# Altium project Placa potência rev. C.PrjPcb
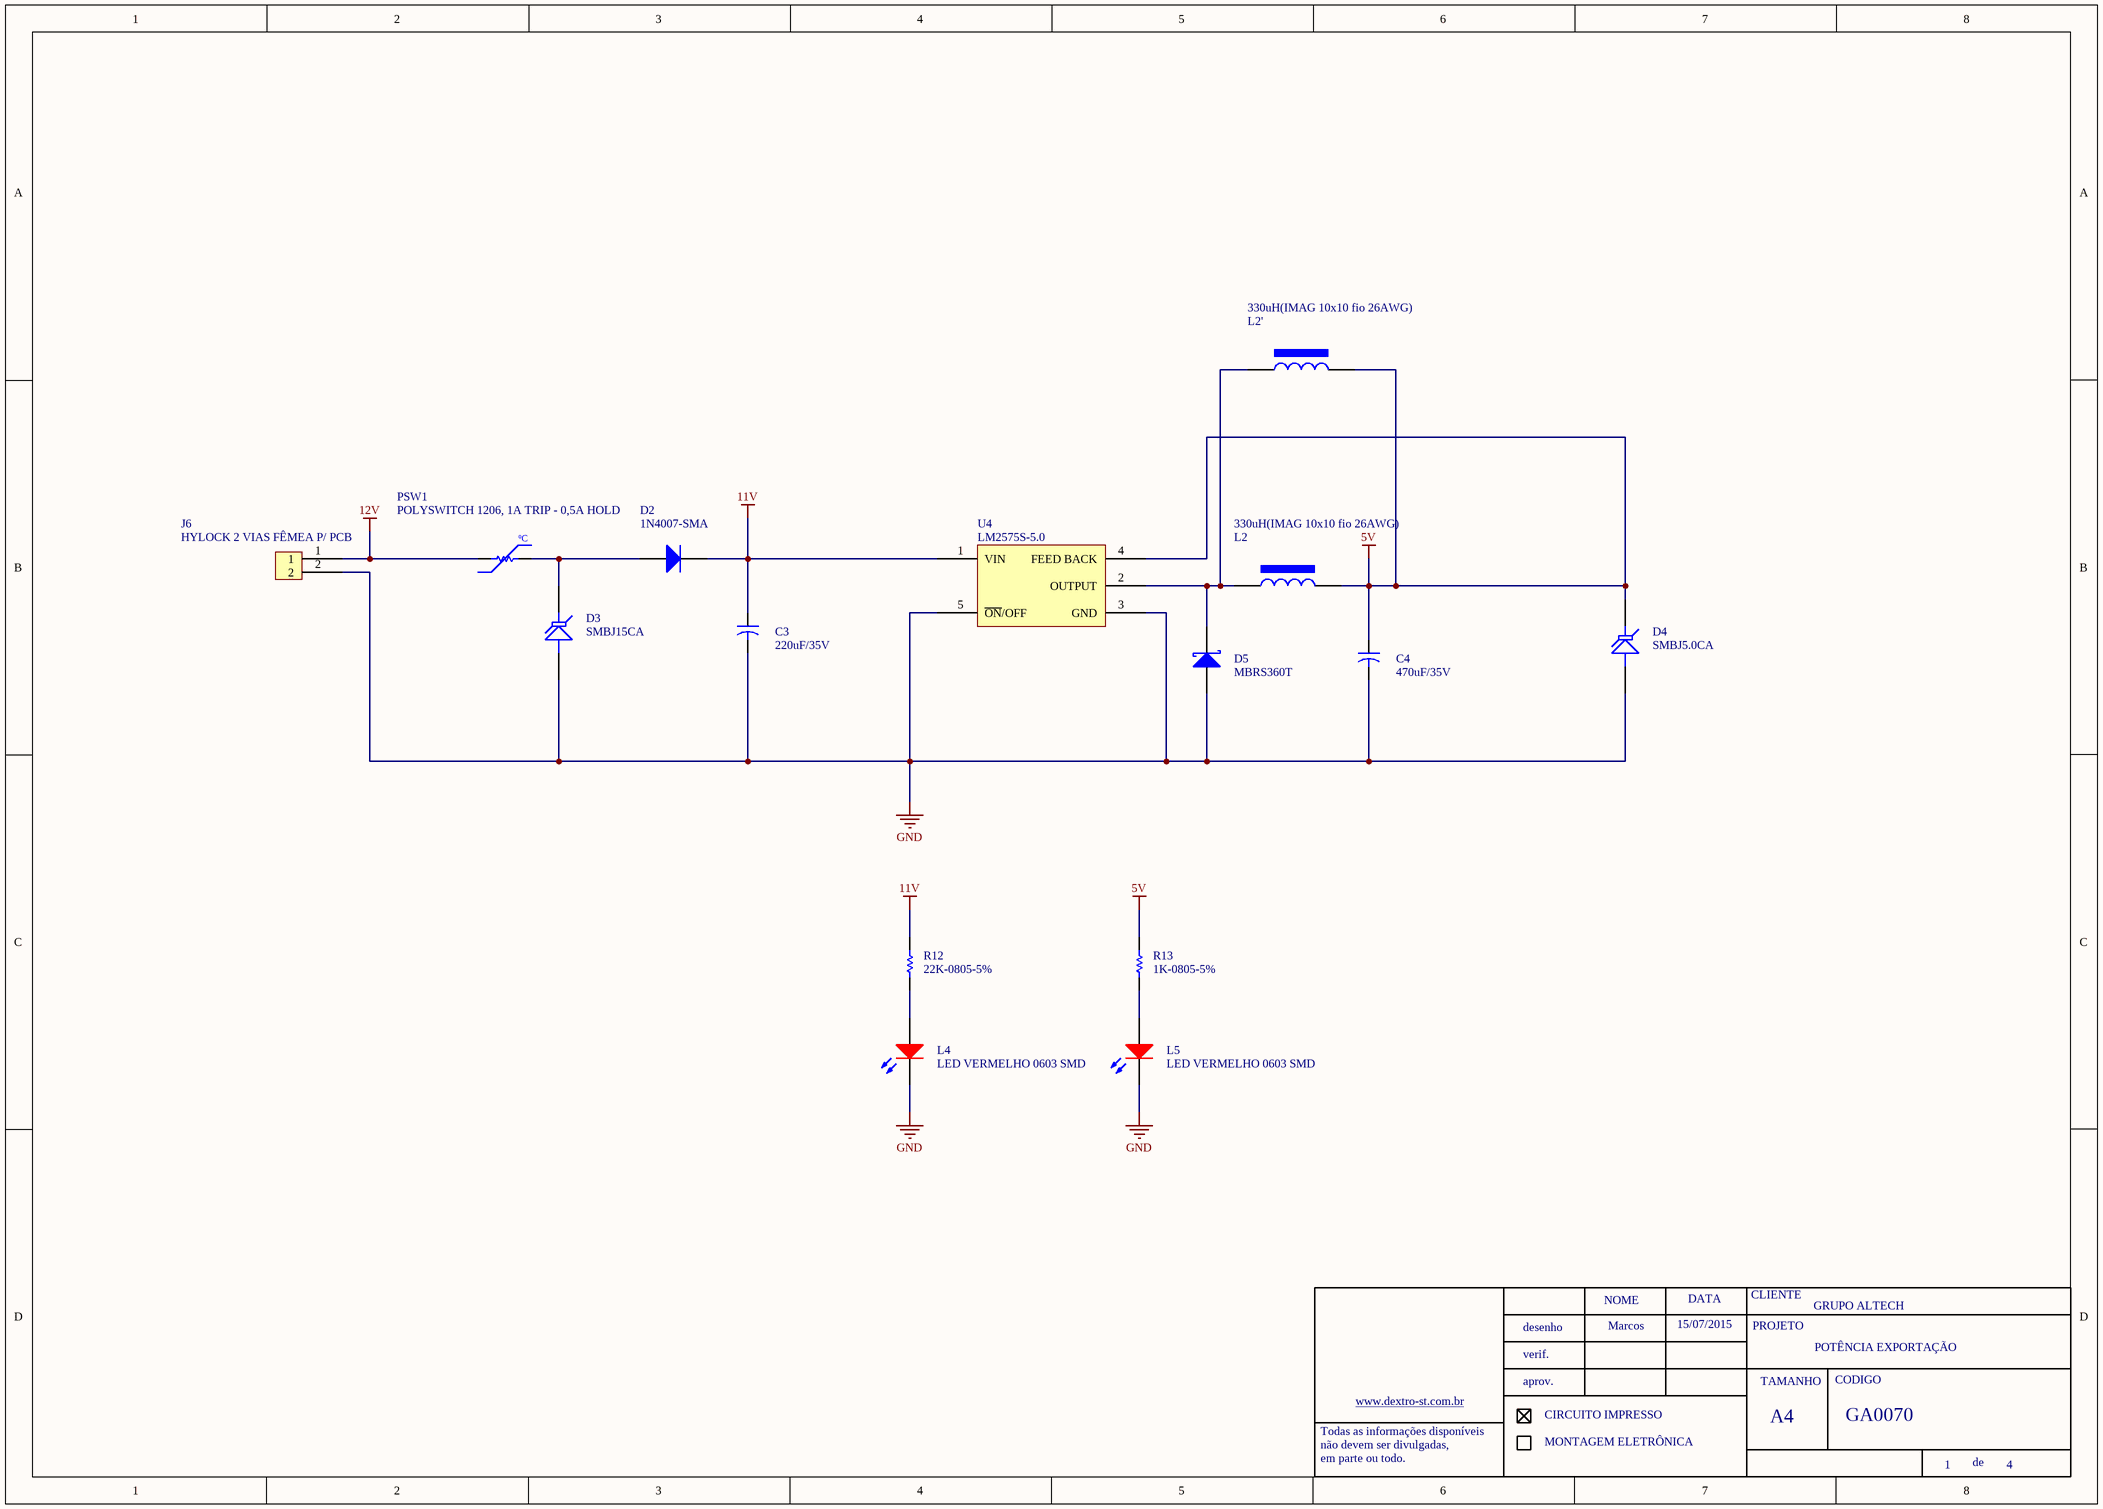
[diagram p0: Regulador.SchDoc]
5 sheets, 80 parts. Net scope: global (net labels, ports and power ports of the same name join across sheets).
Board file: PlacaPotenciaMPG2.PcbDoc
Sheets:
  Regulador.SchDoc
  Sincronismo.SchDoc
  Conectores.SchDoc
  Potencia.SchDoc
  ControleSSR.SchDoc

## Sheet Regulador.SchDoc: GRUPO ALTECH
size A3; DocumentNumber: GA0070; SheetNumber: 1; SheetTotal: 4

### Parts
C3  220uF/35V  [CAP POL 8x12mm]
C4  470uF/35V  [CAP POL 8x12mm]
D2  1N4007-SMA  [DO-214AA]
D3  SMBJ15CA  [DO-214AA]
D4  SMBJ5.0CA  [DO-214AA]
D5  MBRS360T  [DO-214AA]
J6  HYLOCK 2 VIAS FÊMEA P/ PCB  [CONECTOR HYLOCK 2 VIAS]
L2  330uH(IMAG 10x10 fio 26AWG)  [INDUTOR 47mH]
L2'  330uH(IMAG 10x10 fio 26AWG)  [INDUTOR LOCO]
L4  LED VERMELHO 0603 SMD  [LED 1206]
L5  LED VERMELHO 0603 SMD  [LED 1206]
PSW1  POLYSWITCH 1206, 1A TRIP - 0,5A HOLD  [1206-REVISADO ONDA]
R12  22K-0805-5%  [0805-REVISADO ONDA]
R13  1K-0805-5%  [0805-REVISADO ONDA]
U4  LM2575S-5.0  [TO-263-5]

### Nets
5V: C4.1 D4.2(K) L2.1 L2'.1 R13.2 U4.4(FEED_BACK)
11V: C3.1 D2.2(K) R12.2 U4.1(VIN)
12V: J6.1 PSW1.1
GND: C3.2 C4.2 D3.1(A) D4.1(A) D5.1(A) J6.2 L4.2(K) L5.2(K) U4.3(GND) U4.5(~{ON}/OFF)
NetD2_1: D2.1(A) D3.2(K) PSW1.2
NetD5_2: D5.2(K) L2.2 L2'.2 U4.2(OUTPUT)
NetL4_1: L4.1(A) R12.1
NetL5_1: L5.1(A) R13.1

### Notes on the sheet
- Marcos
- 15/07/2015
- POTÊNCIA EXPORTAÇÃO
- NOME
- DATA
- CLIENTE
- PROJETO
- desenho
- verif.
- aprov.
- TAMANHO
- CODIGO
- Todas as informações disponíveis
- não devem ser divulgadas,
- em parte ou todo.
- www.dextro-st.com.br
- CIRCUITO IMPRESSO
- MONTAGEM ELETRÔNICA
- A4
- de
- (in symbol POLYSWITCH 200mA) ºC

### Library data of the parts
C3 = 2200uF/50V: ERP: 105.01.008
C4 = 470uF/50V: ERP: 105.01.005
D2 = 1N4007: ERP: 120.18.001
D3 = SMBJ30.0A: ERP: 128.02.003
D4 = SMBJ5.0A: ERP: 128.02.002
D5 = 1N5819-SOD80: ERP: 121.18.003
J6 = PCMC2-2
L2 L2' = indutor 1mH CNF15: 1mH-CNF15-26 AWG; ERP: 211.00.012
PSW1 = POLYSWITCH 200mA: NANOSMDC020F-2; ERP: 128.12.002
R13 = 22K-0805-5%: ERP: 102.11.058
U4 = LM2596S-ADJ
L4 L5 = LED VERMELHO 0603 SMD: ERP: 124.02.010
R12 = 22K-0805-5%: ERP: 102.11.058

## Sheet Sincronismo.SchDoc: GRUPO ALTECH
size A3; DocumentNumber: GA0070; SheetNumber: 2; SheetTotal: 4; PageSetup: Record=PageOptions|CenterHorizontal=True|CenterVertical=True|PrintScale=0.71|XCorrection=1.00|YCorrection=1.00|PrintKind=0|BorderSize=5000000|LeftOffset=0|BottomOffset=0|Orientation=2|PaperLength=1000|PaperWidth=1000|Scale=100|PaperSource=7|PrintQuality=-3|MediaType=1|DitherType=10|PrintScaleMode=1|PaperKind=A4|PaperIndex=9
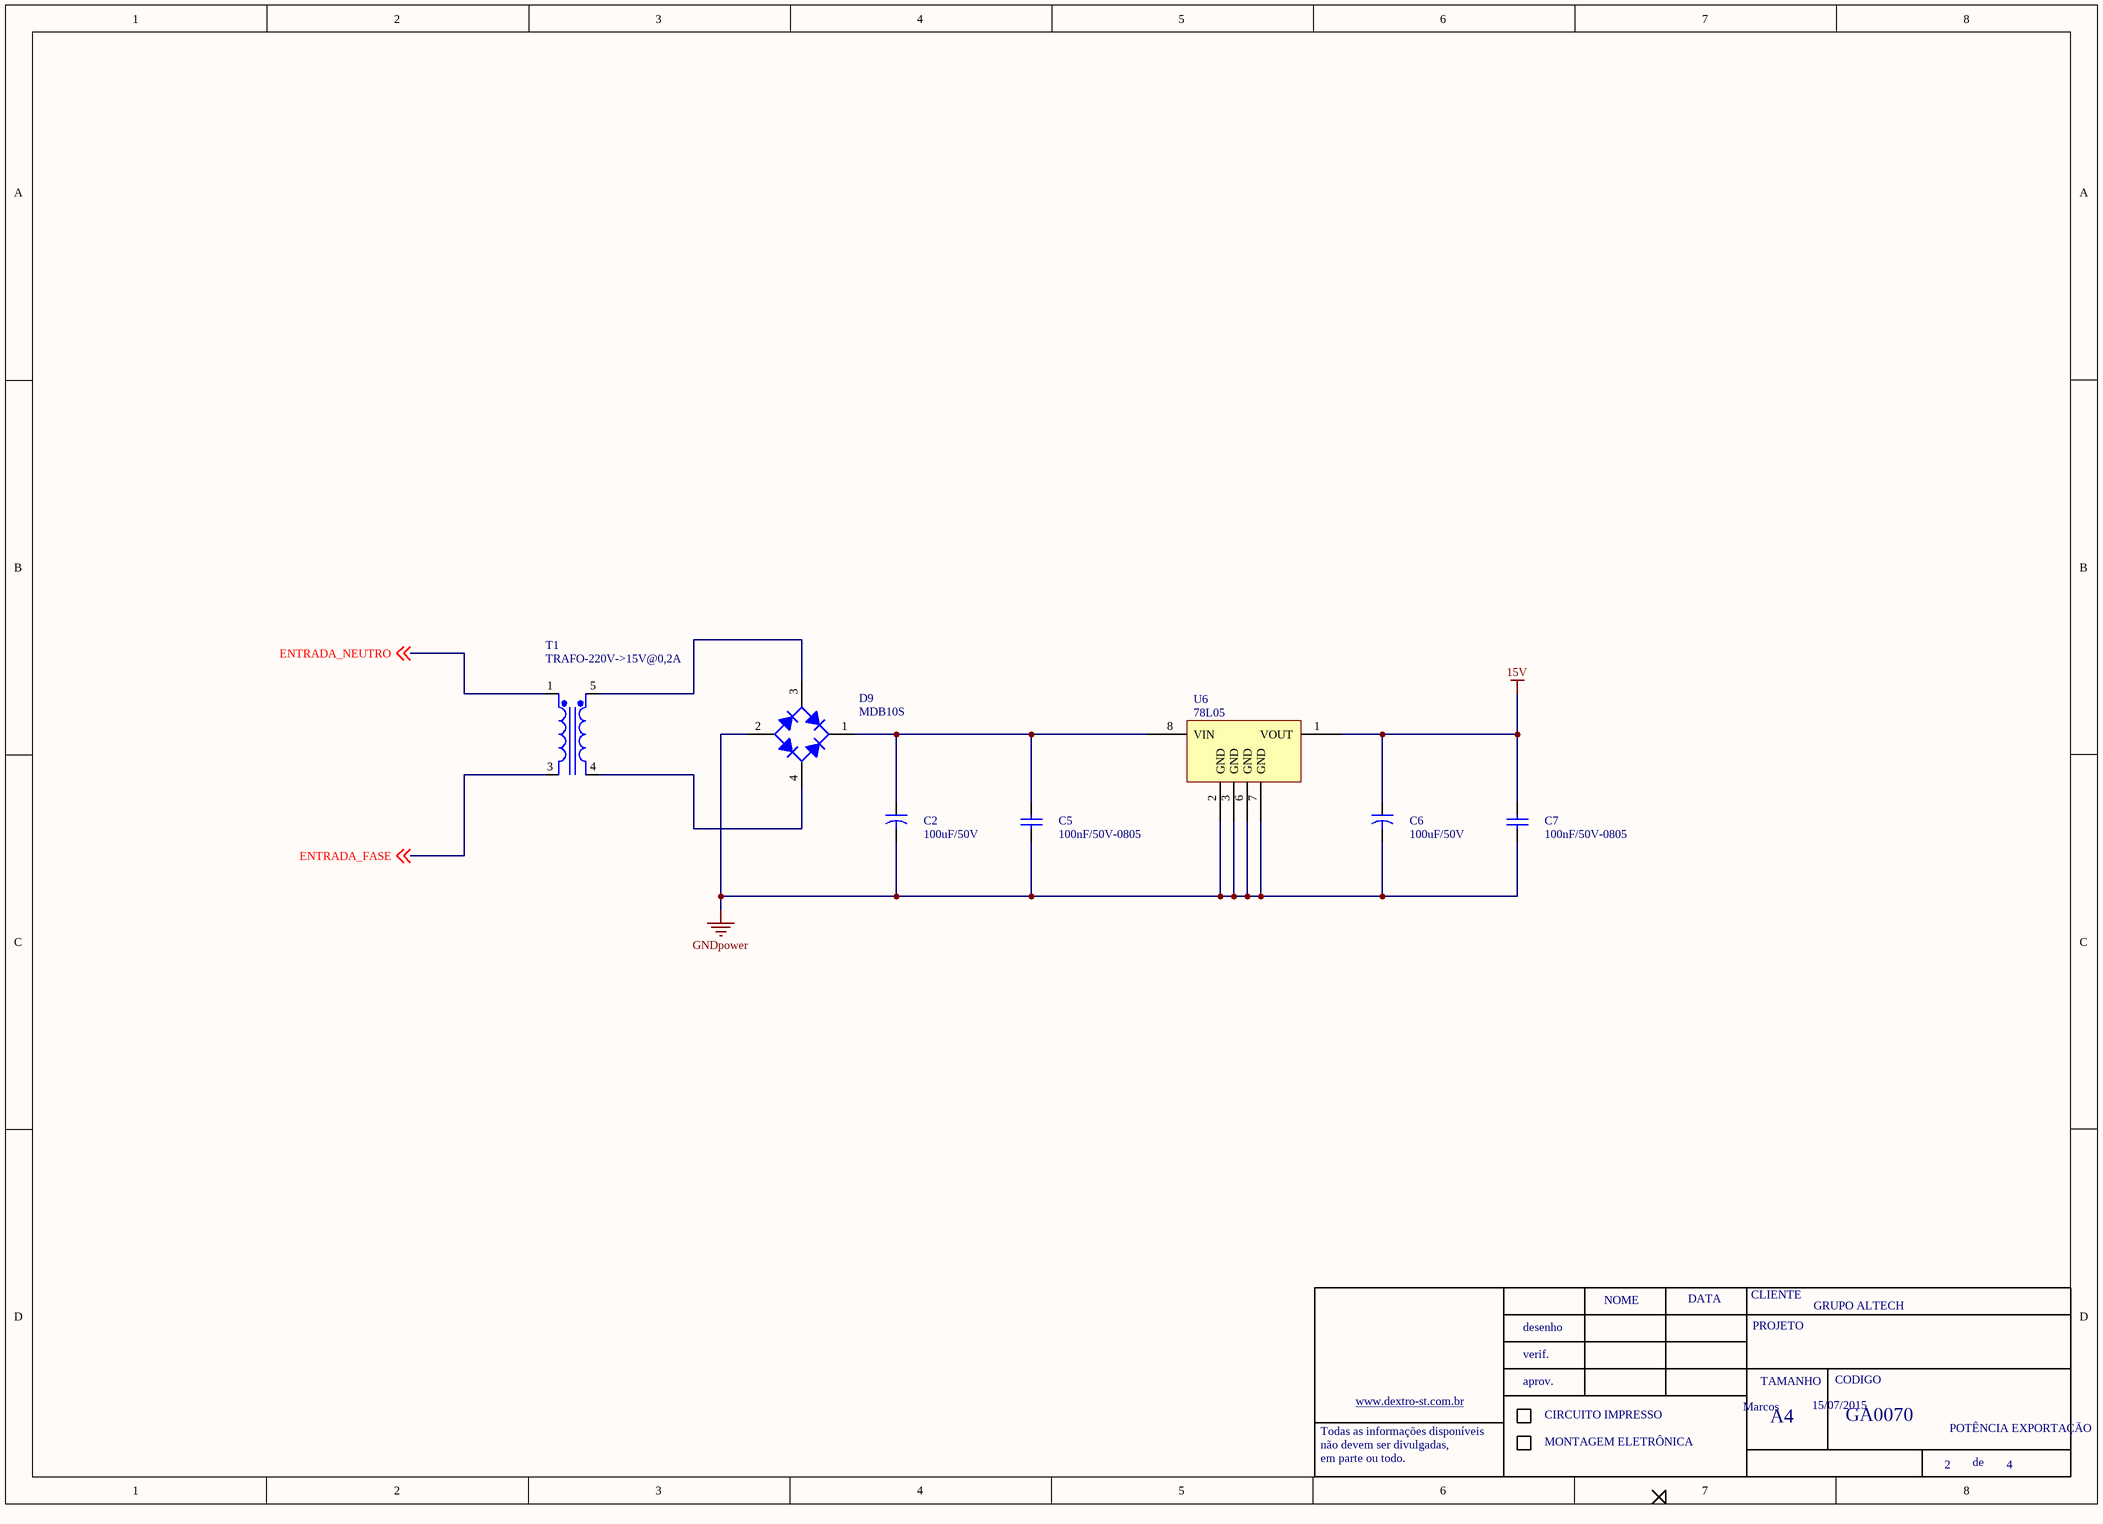
[diagram p1: Sincronismo.SchDoc]

### Parts
C2  100uF/50V  [CAP POL 8x12mm]
C5  100nF/50V-0805  [0805-REVISADO ONDA]
C6  100uF/50V  [CAP POL 8x12mm]
C7  100nF/50V-0805  [0805-REVISADO ONDA]
D9  MDB10S  [MICRO DIP MDB10S]
T1  TRAFO-220V->15V@0,2A
U6  78L05  [SOIC-08]

### Nets
15V: C6.1 C7.2 U6.1(VOUT)
GNDpower: C2.2 C5.1 C6.2 C7.1 D9.2(A) U6.2(GND) U6.3(GND) U6.6(GND) U6.7(GND)
ENTRADA_FASE: T1.3 ; off-sheet ENTRADA_FASE
ENTRADA_NEUTRO: T1.1 ; off-sheet ENTRADA_NEUTRO
NetC2_1: C2.1 C5.2 D9.1(K) U6.8(VIN)
NetD9_3: D9.3(C) T1.5
NetD9_4: D9.4(C) T1.4

### Notes on the sheet
- Marcos
- 15/07/2015
- POTÊNCIA EXPORTAÇÃO
- NOME
- DATA
- CLIENTE
- PROJETO
- desenho
- verif.
- aprov.
- TAMANHO
- CODIGO
- Todas as informações disponíveis
- não devem ser divulgadas,
- em parte ou todo.
- www.dextro-st.com.br
- CIRCUITO IMPRESSO
- MONTAGEM ELETRÔNICA
- A4
- de

### Library data of the parts
C5 C7 = 100nF/50-0805-NPO: ERP: 104.11.005
T1 = TRAFO CORRENTE: TRAFO CORRENTE 1A-5V; ERP: 210.00.006
U6 = 78L05-SOIC
C2 C6 = 100uF/50V: ERP: 105.01.003

## Sheet Conectores.SchDoc: GRUPO ALTECH
size A3; DocumentNumber: GA0070; SheetNumber: 3; SheetTotal: 4
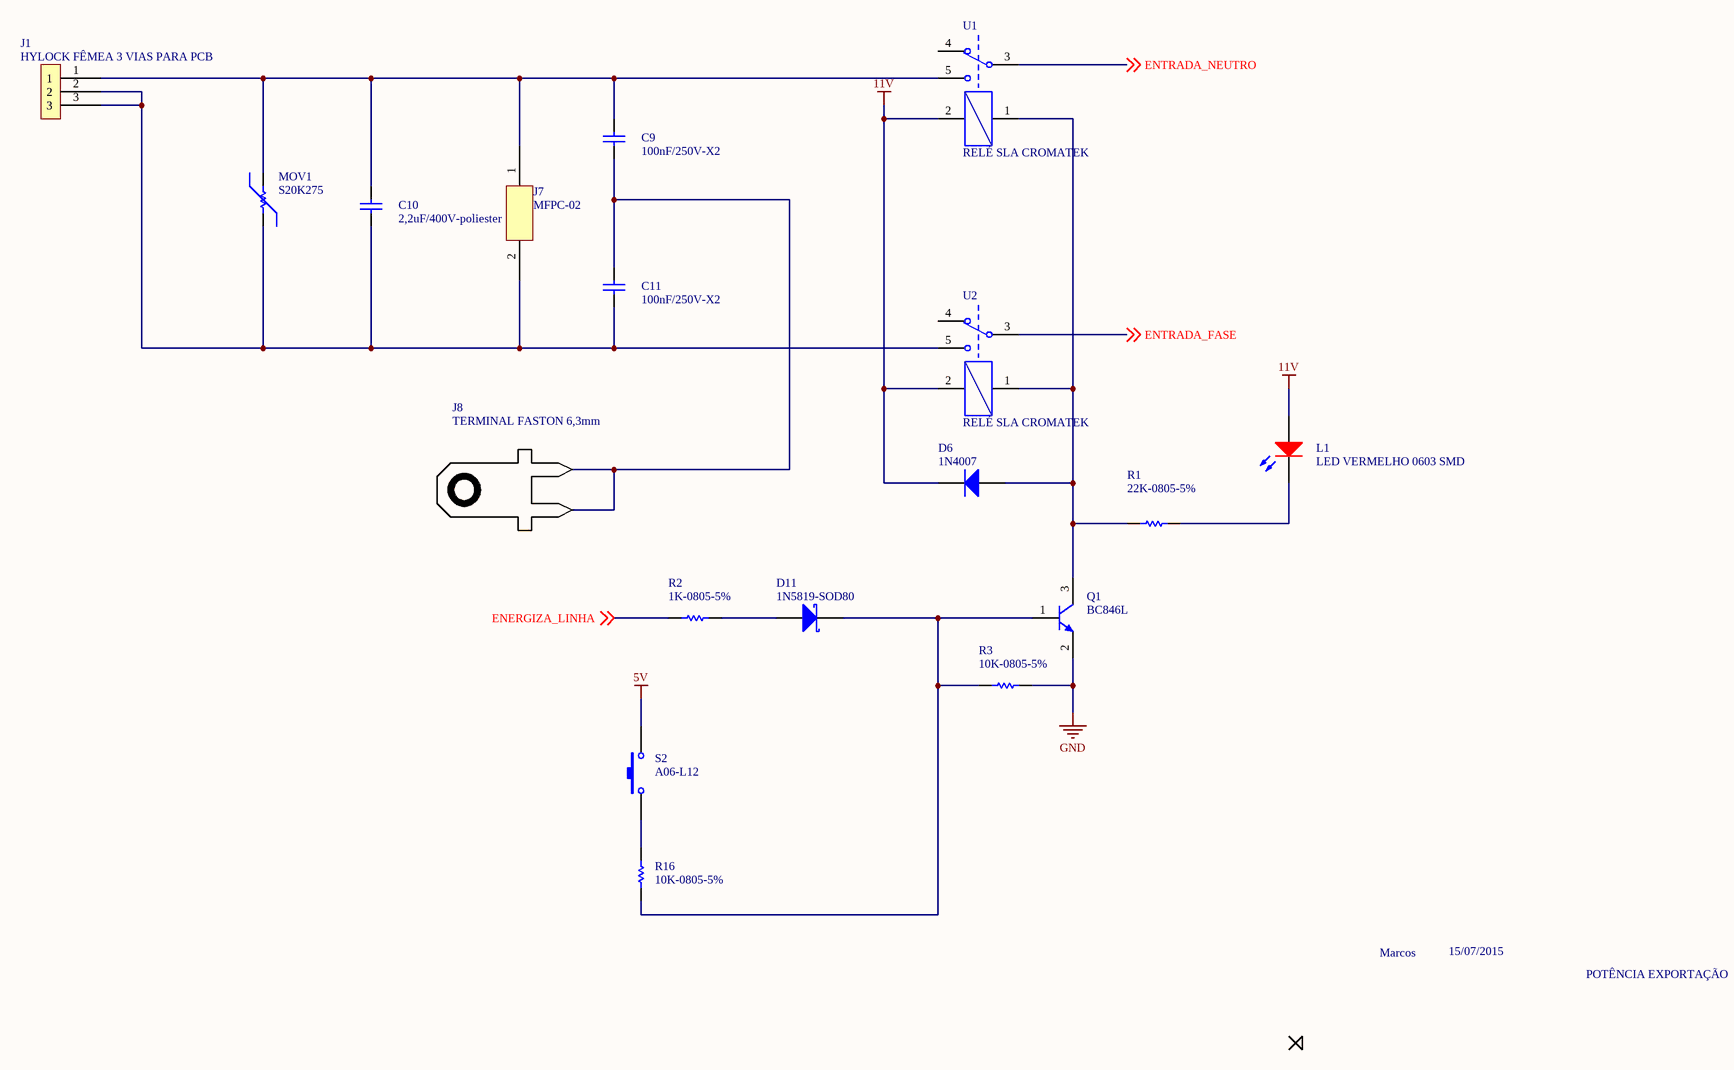
[diagram p2: Conectores.SchDoc]

### Parts
C9  100nF/250V-X2  [CAP-250V-PS]
C10  2,2uF/400V-poliester  [CAPACITOR H4]
C11  100nF/250V-X2  [CAP-250V-PS]
D6  1N4007  [SMA DIODES]
D11  1N5819-SOD80  [MINIMLEF/SOD80 - REVISADO ONDA]
J1  HYLOCK FÊMEA 3 VIAS PARA PCB  [CONECTOR HYLOCK 3 VIAS]
J7  MFPC-02  [MFPC-02]
J8  TERMINAL FASTON 6,3mm  [TERMINAL FASTON]
L1  LED VERMELHO 0603 SMD  [LED 1206]
MOV1  S20K275  [VARISTOR 20mm]
Q1  BC846L  [SOT23 - REVISADO ONDA]
R1  22K-0805-5%  [0805-REVISADO ONDA]
R2  1K-0805-5%  [0805-REVISADO ONDA]
R3  10K-0805-5%  [0805-REVISADO ONDA]
R16  10K-0805-5%  [0805-REVISADO ONDA]
S2  A06-L12  [CHAVE_A06]
U1  RELÉ SLA CROMATEK  [RELE SLA CROMATEK]
U2  RELÉ SLA CROMATEK  [RELE SLA CROMATEK]

### Nets
5V: S2.2
11V: D6.2(K) L1.1(A) U1.2(A2) U2.2(A2)
GND: Q1.2(E) R3.2
ENERGIZA_LINHA: R2.1 ; off-sheet ENERGIZA_LINHA
ENTRADA_FASE: U2.3 ; off-sheet ENTRADA_FASE
ENTRADA_NEUTRO: U1.3 ; off-sheet ENTRADA_NEUTRO
NetC9_1: C9.1 C11.2 J8.1 J8.2
NetC9_2: C9.2 C10.2 J1.1 J7.1 MOV1.2 U1.5
NetC10_1: C10.1 C11.1 J1.2 J1.3 J7.2 MOV1.1 U2.5
NetD6_1: D6.1(A) Q1.3(C) R1.1 U1.1(A1) U2.1(A1)
NetD11_1: D11.1(A) R2.2
NetD11_2: D11.2(K) Q1.1(B) R3.1 R16.1
NetL1_2: L1.2(K) R1.2
NetR16_2: R16.2 S2.1

Not connected (* = marked no-connect by the designer): U1 4; U2 4

### Notes on the sheet
- Marcos
- 15/07/2015
- POTÊNCIA EXPORTAÇÃO
- NOME
- DATA
- CLIENTE
- PROJETO
- desenho
- verif.
- aprov.
- TAMANHO
- CODIGO
- Todas as informações disponíveis
- não devem ser divulgadas,
- em parte ou todo.
- www.dextro-st.com.br
- CIRCUITO IMPRESSO
- MONTAGEM ELETRÔNICA
- A4
- de

### Library data of the parts
C9-C11 = 100nF/50-0805-NPO: 100nF/50V-0805; ERP: 104.11.005
J1 = PCMC2-3
J7 = MFPL-02
Q1 = BC846: ERP: 106.22.001
R2 = 10K-0805-5%: ERP: 102.11.054
R16 = 1K-0805-5%: ERP: 102.11.042
D6 = 1N4007: ERP: 120.18.001
D11 = 1N5819-SOD80: ERP: 121.18.003
J8 = TERMINAL FASTON 6,3mm: ERP: 431.00.010
L1 = LED VERMELHO 0603 SMD: ERP: 124.02.010
R1 = 22K-0805-5%: ERP: 102.11.058
R3 = 10K-0805-5%: ERP: 102.11.054
S2 = A06-L12: ERP: 136.00.001

## Sheet Potencia.SchDoc: GRUPO ALTECH
size A3; DocumentNumber: GA0070; SheetNumber: 4; SheetTotal: 4
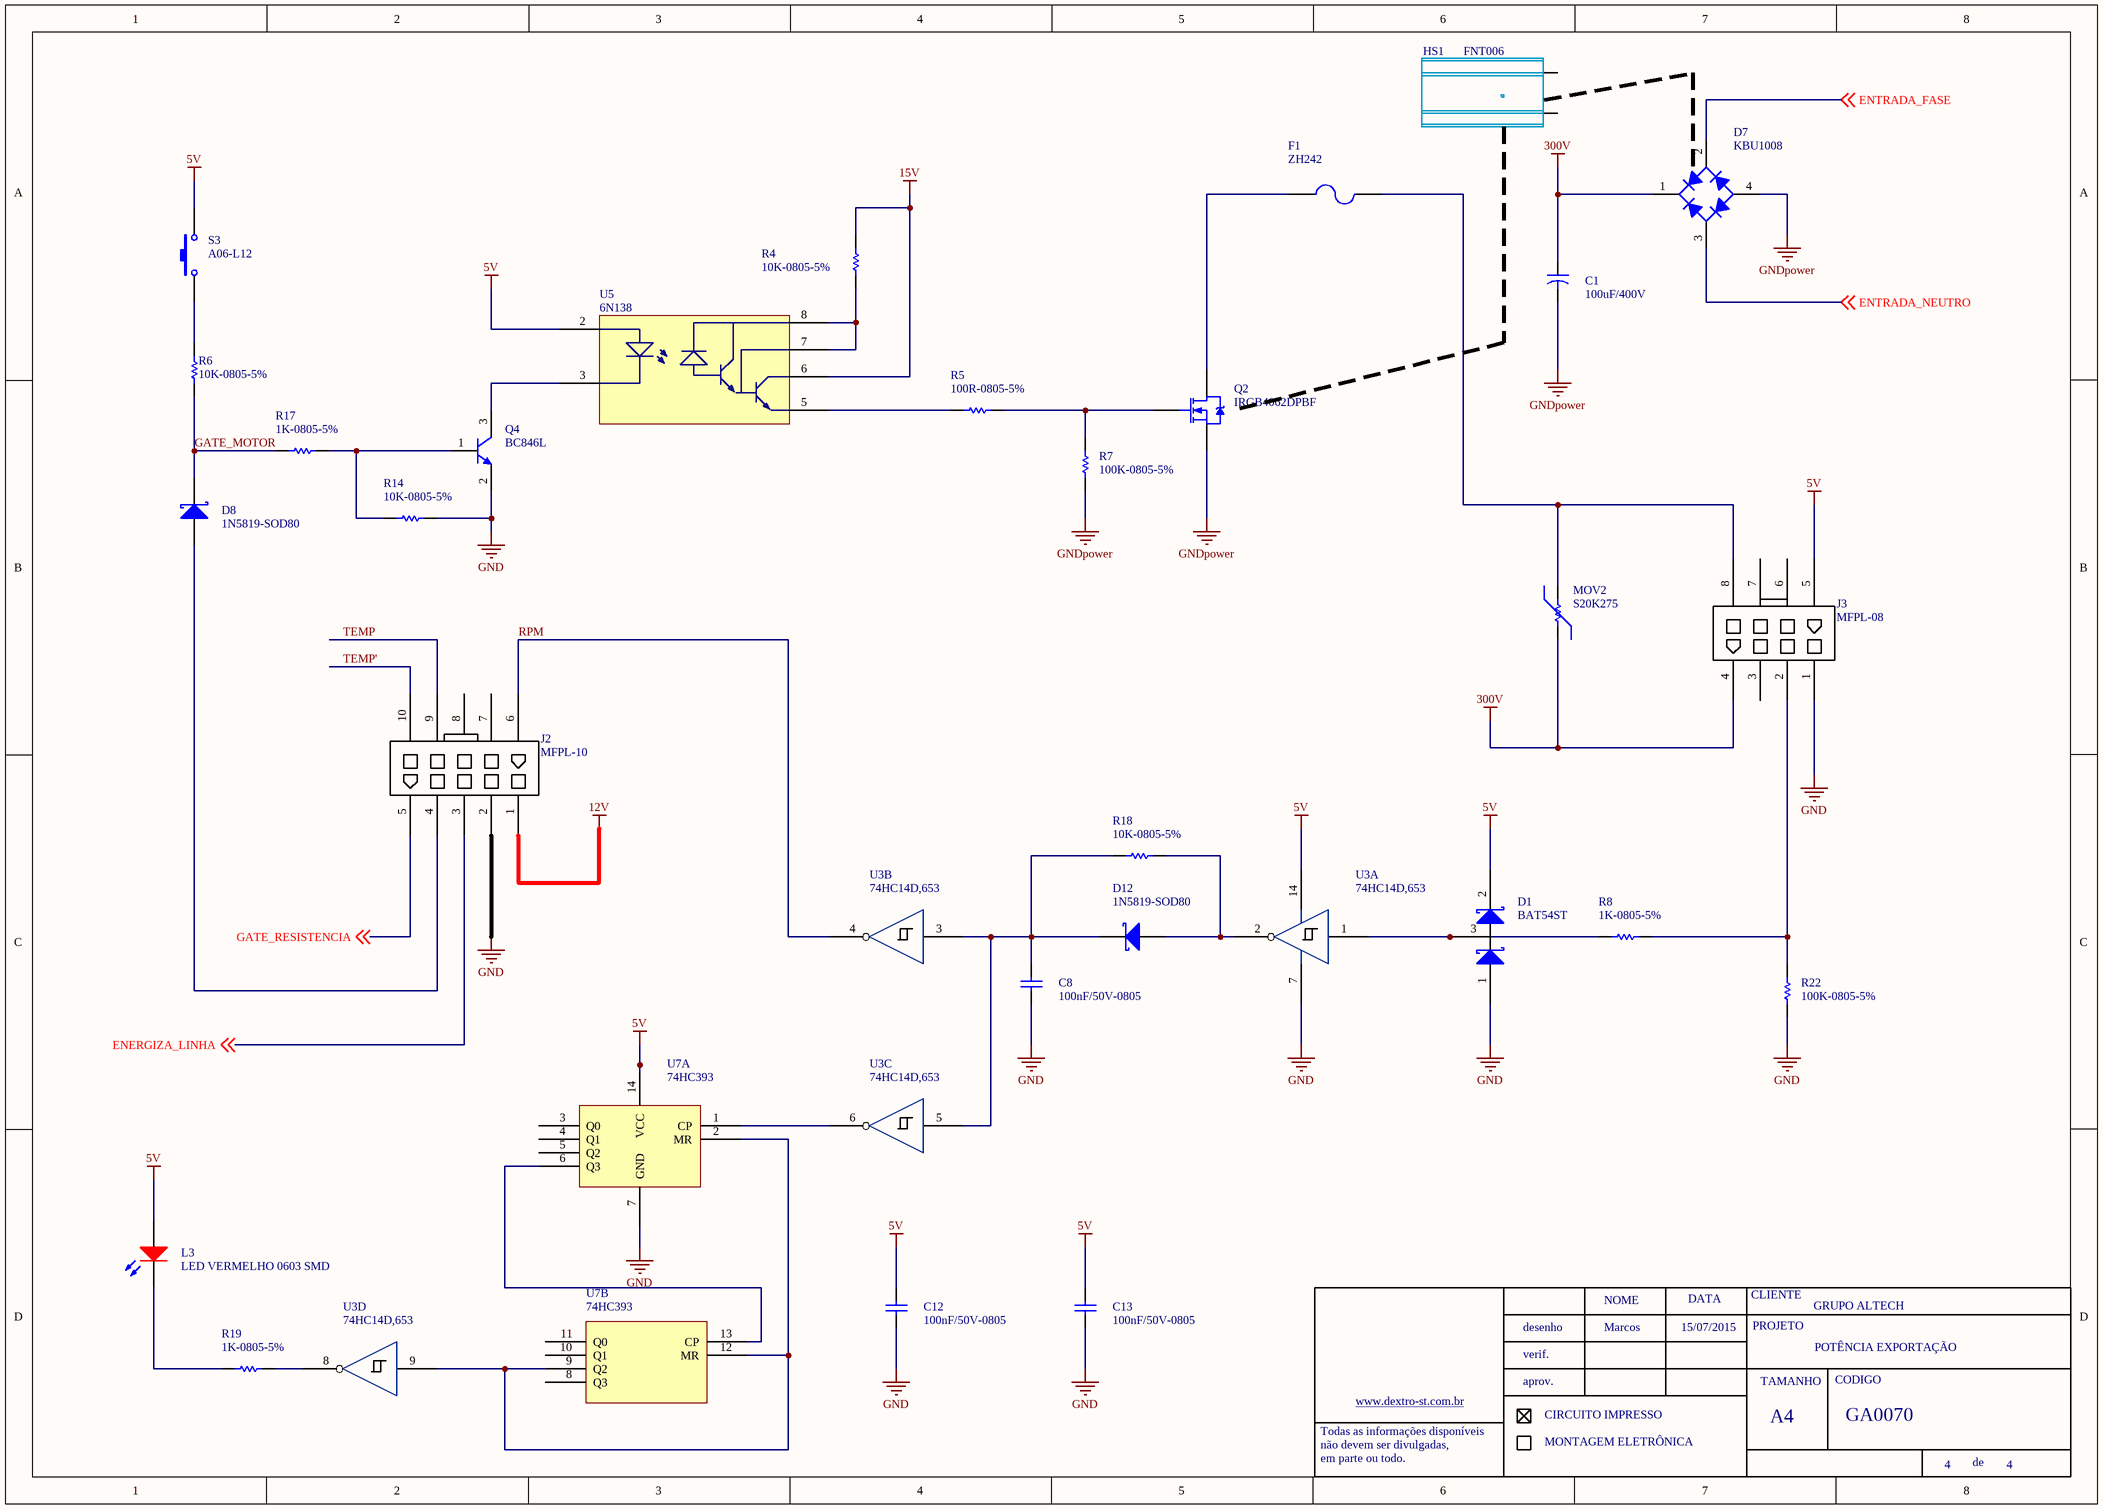
[diagram p3: Potencia.SchDoc]

### Parts
C1  100uF/400V  [CAP 470UF/400V HITANO]
C8  100nF/50V-0805  [0805-REVISADO ONDA]
C12  100nF/50V-0805  [0805-REVISADO ONDA]
C13  100nF/50V-0805  [0805-REVISADO ONDA]
D1  BAT54ST  [SOT23 - REVISADO ONDA]
D7  KBU1008  [KBU-810]
D8  1N5819-SOD80  [MINIMLEF/SOD80 - REVISADO ONDA]
D12  1N5819-SOD80  [MINIMLEF/SOD80 - REVISADO ONDA]
F1  ZH242  [ZH242_REVISADO]
HS1  FNT006  [dissipador grande]
J2  MFPL-10  [MFPC-10]
J3  MFPL-08  [MFPC-08]
L3  LED VERMELHO 0603 SMD  [LED 1206]
MOV2  S20K275  [VARISTOR 20mm]
Q2  IRGB4062DPBF  [TO220-3 EM PÉ]
Q4  BC846L  [SOT23 - REVISADO ONDA]
R4  10K-0805-5%  [0805-REVISADO ONDA]
R5  100R-0805-5%  [0805-REVISADO ONDA]
R6  10K-0805-5%  [0805-REVISADO ONDA]
R7  100K-0805-5%  [0805-REVISADO ONDA]
R8  1K-0805-5%  [0805-REVISADO ONDA]
R14  10K-0805-5%  [0805-REVISADO ONDA]
R17  1K-0805-5%  [0805-REVISADO ONDA]
R18  10K-0805-5%  [0805-REVISADO ONDA]
R19  1K-0805-5%  [0805-REVISADO ONDA]
R22  100K-0805-5%  [0805-REVISADO ONDA]
S3  A06-L12  [CHAVE_A06]
U3  74HC14D,653  [SOIC 14 PINOS]  (parts A,B,C,D of 6)
U5  6N138  [DIP-8]
U7  74HC393  [SOIC 14 PINOS]  (parts A,B of 2)

### Nets
5V: C12.2 C13.2 D1.2 J3.5 L3.1(A) S3.2 U3.14(VCC) U5.2(A) U7.14(VCC)
12V: J2.1
15V: R4.2 U5.6
300V: C1.1 D7.1(K) J3.4 MOV2.2
GND: C8.1 C12.1 C13.1 D1.1 J2.2 J3.1 Q4.2(E) R14.2 R22.1 U3.7(GND) U7.7(GND)
GNDpower: C1.2 D7.4(A) Q2.3(S) R7.1
ENERGIZA_LINHA: J2.3 ; off-sheet ENERGIZA_LINHA
ENTRADA_FASE: D7.2(C) ; off-sheet ENTRADA_FASE
ENTRADA_NEUTRO: D7.3(C) ; off-sheet ENTRADA_NEUTRO
GATE_MOTOR: D8.2(K) R6.2 R17.1
GATE_RESISTENCIA: J2.5 ; off-sheet GATE_RESISTENCIA
RPM: J2.6 U3.4
TEMP: J2.9
TEMP': J2.10
NetC8_2: C8.2 D12.2(K) R18.1 U3.3 U3.5
NetD1_3: D1.3 R8.1 U3.1
NetD8_1: D8.1(A) J2.4
NetD12_1: D12.1(A) R18.2 U3.2
NetF1_1: F1.1 J3.8 MOV2.1
NetF1_2: F1.2 Q2.2(D)
NetJ3_2: J3.2 R8.2 R22.2
NetL3_2: L3.2(K) R19.2
NetQ2_1: Q2.1(G) R5.2 R7.2
NetQ4_1: Q4.1(B) R14.1 R17.2
NetQ4_3: Q4.3(C) U5.3(K)
NetR4_1: R4.1 U5.7 U5.8
NetR5_1: R5.1 U5.5(GND)
NetR6_1: R6.1 S3.1
NetR19_1: R19.1 U3.8
NetU3_6: U3.6 U7.1(CP)
NetU3_9: U3.9 U7.2(MR) U7.9(Q2) U7.12(MR)
NetU7_6: U7.6(Q3) U7.13(CP)

Not connected (* = marked no-connect by the designer): HS1 0 1; J2 7 8; J3 3 6 7; U7 3(Q0) 4(Q1) 5(Q2) 8(Q3) 10(Q1) 11(Q0)

### Notes on the sheet
- Marcos
- 15/07/2015
- POTÊNCIA EXPORTAÇÃO
- NOME
- DATA
- CLIENTE
- PROJETO
- desenho
- verif.
- aprov.
- TAMANHO
- CODIGO
- Todas as informações disponíveis
- não devem ser divulgadas,
- em parte ou todo.
- www.dextro-st.com.br
- CIRCUITO IMPRESSO
- MONTAGEM ELETRÔNICA
- A4
- de

### Library data of the parts
C1 = 100uF/50V: ERP: 105.01.003
C8 C12 C13 = 100nF/50-0805-NPO: ERP: 104.11.005
D7 = KBU 1008: ERP: 170.01.001
F1 = PORTA FUSÍVEL TIPO BERÇO: ERP: 426.00.002
HS1 = DISSIPADOR 40mm PÉ
Q2 = IRF740: ERP: 107.01.021
Q4 = BC846: ERP: 106.22.001
R4 = 100R-0805-5%: ERP: 102.11.031
R17 = 10K-0805-5%: ERP: 102.11.054
U3 = 74HC14D
U5 = 6N138: ERP: FALTA CADASTRAR
D8 D12 = 1N5819-SOD80: ERP: 121.18.003
L3 = LED VERMELHO 0603 SMD: ERP: 124.02.010
R5 = 100R-0805-5%: ERP: 102.11.031
R6 R14 R18 = 10K-0805-5%: ERP: 102.11.054
R7 R22 = 100K-0805-5%: ERP: 102.11.066
R8 R19 = 1K-0805-5%: ERP: 102.11.042
S3 = A06-L12: ERP: 136.00.001

## Sheet ControleSSR.SchDoc
size A3
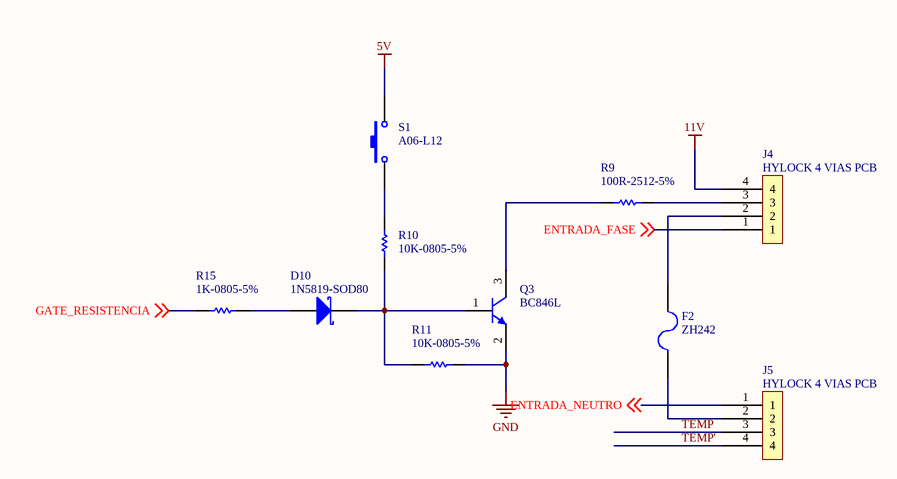
[diagram p4: ControleSSR.SchDoc]

### Parts
D10  1N5819-SOD80  [MINIMLEF/SOD80 - REVISADO ONDA]
F2  ZH242  [ZH242_REVISADO]
J4  HYLOCK 4 VIAS PCB  [CONECTOR HYLOK 4 VIAS]
J5  HYLOCK 4 VIAS PCB  [CONECTOR HYLOK 4 VIAS]
Q3  BC846L
R9  100R-2512-5%  [2512 - REVISADO ONDA]
R10  10K-0805-5%  [0805-REVISADO ONDA]
R11  10K-0805-5%  [0805-REVISADO ONDA]
R15  1K-0805-5%  [0805-REVISADO ONDA]
S1  A06-L12  [CHAVE_A06]

### Nets
5V: S1.2
11V: J4.4
GND: Q3.2(E) R11.2
ENTRADA_FASE: J4.1 ; off-sheet ENTRADA_FASE
ENTRADA_NEUTRO: J5.1 ; off-sheet ENTRADA_NEUTRO
GATE_RESISTENCIA: R15.1 ; off-sheet GATE_RESISTENCIA
TEMP: J5.3
TEMP': J5.4
NetD10_1: D10.1(A) R15.2
NetD10_2: D10.2(K) Q3.1(B) R10.1 R11.1
NetF2_1: F2.1 J4.2
NetF2_2: F2.2 J5.2
NetJ4_3: J4.3 R9.2
NetQ3_3: Q3.3(C) R9.1
NetR10_2: R10.2 S1.1

### Notes on the sheet
- NOME
- DATA
- CLIENTE
- PROJETO
- desenho
- verif.
- aprov.
- TAMANHO
- CODIGO
- Todas as informações disponíveis
- não devem ser divulgadas,
- em parte ou todo.
- www.dextro-st.com.br
- CIRCUITO IMPRESSO
- MONTAGEM ELETRÔNICA
- A4
- de

### Library data of the parts
F2 = PORTA FUSÍVEL TIPO BERÇO: ERP: 426.00.002
J4 J5 = PCMC2-4
Q3 = BC846: ERP: 106.22.001
R9 = 100R-0805-5%: ERP: 102.11.031
R10 = 1K-0805-5%: ERP: 102.11.042
D10 = 1N5819-SOD80: ERP: 121.18.003
R11 = 10K-0805-5%: ERP: 102.11.054
R15 = 1K-0805-5%: ERP: 102.11.042
S1 = A06-L12: ERP: 136.00.001

## Nets that join several sheets
5V: Regulador (6 pins), Conectores (S2.2), Potencia (9 pins), ControleSSR (S1.2)
11V: Regulador (C3.1 D2.2 R12.2 U4.1), Conectores (D6.2 L1.1 U1.2 U2.2), ControleSSR (J4.4)
12V: Regulador (J6.1 PSW1.1), Potencia (J2.1)
15V: Sincronismo (C6.1 C7.2 U6.1), Potencia (R4.2 U5.6)
GND: Regulador (10 pins), Conectores (Q1.2 R3.2), Potencia (11 pins), ControleSSR (Q3.2 R11.2)
GNDpower: Sincronismo (9 pins), Potencia (C1.2 D7.4 Q2.3 R7.1)
ENERGIZA_LINHA: Conectores (R2.1), Potencia (J2.3)
ENTRADA_FASE: Sincronismo (T1.3), Conectores (U2.3), Potencia (D7.2), ControleSSR (J4.1)
ENTRADA_NEUTRO: Sincronismo (T1.1), Conectores (U1.3), Potencia (D7.3), ControleSSR (J5.1)
GATE_RESISTENCIA: Potencia (J2.5), ControleSSR (R15.1)
TEMP: Potencia (J2.9), ControleSSR (J5.3)
TEMP': Potencia (J2.10), ControleSSR (J5.4)